# EAGLE schematic tomada (EAGLE 6.4)
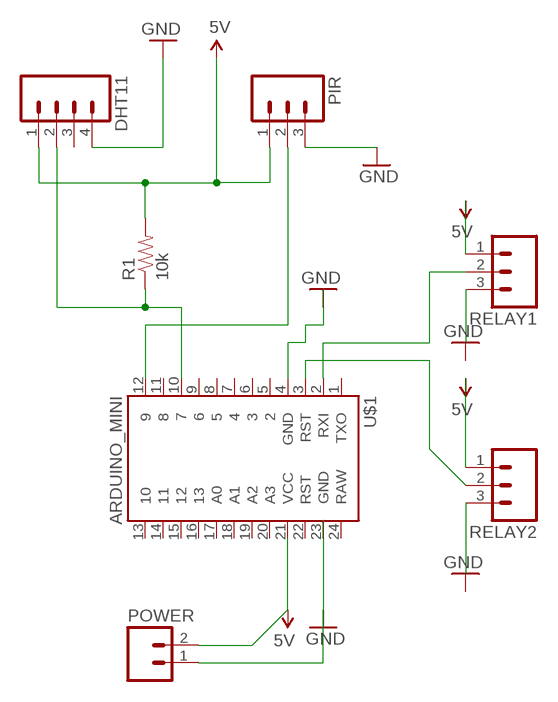
[diagram p0: schematic, sheet 1]

## Parts
DHT11  M04PTH  [1X04]
PIR  M03PTH  [1X03]
POWER  M02PTH4  [1X02_XTRA_BIG]
R1  10k  RESISTORPTH-1/4W  [AXIAL-0.4]
RELAY1  M03PTH  [1X03]
RELAY2  M03PTH  [1X03]
U$1  ARDUINO_MINI  [ARDUINO_MINI]

## Nets
5V: DHT11.1 PIR.1 POWER.2 R1.P$2 RELAY1.1 RELAY2.1 U$1.21(VCC)
GND: DHT11.4 PIR.3 POWER.1
N$1: PIR.2 U$1.12
N$2: RELAY1.2 U$1.2(RXI)
N$3: DHT11.2 R1.P$1 U$1.10
N$4: RELAY1.3
N$5: RELAY2.2 U$1.3(RST)
N$6: U$1.4(GND)
N$7: RELAY2.3
Unconnected: DHT11.3 U$1.1(TXO) U$1.5 U$1.6 U$1.7 U$1.8 U$1.9 U$1.11 U$1.13 U$1.14 U$1.15 U$1.16 U$1.17(A0) U$1.18(A1) U$1.19(A2) U$1.20(A3) U$1.22(RST) U$1.23(GND) U$1.24(RAW)

## Library data of the parts
DHT11 = SparkFun-Connectors:M04: Header 4 Standard 4-pin 0.1" header. Use with straight break away headers (SKU : PRT-00116), right angle break away headers (PRT-00553), swiss pins (PRT-00743), machine pins (PRT-00117), and female headers (PRT-00115). Molex polarized connector foot print use with SKU : PRT-08231 with associated crimp pins and housings. 1MM SMD Version SKU: PRT-10208
PIR RELAY1 RELAY2 = SparkFun-Connectors:M03: Header 3 Standard 3-pin 0.1" header. Use with straight break away headers (SKU : PRT-00116), right angle break away headers (PRT-00553), swiss pins (PRT-00743), machine pins (PRT-00117), and female headers (PRT-00115). Molex polarized connector foot print use with SKU : PRT-08232 with associated crimp pins and housings.
POWER = SparkFun-Connectors:M02: Standard 2-pin 0.1" header. Use with - straight break away headers ( PRT-00116) - right angle break away headers (PRT-00553) - swiss pins (PRT-00743) - machine pins (PRT-00117) - female headers (PRT-00115) Molex polarized connector foot print use with: PRT-08233 with associated crimp pins and housings. 2.54_SCREWTERM for use with PRT-10571. 3.5mm Screw Terminal footprints for PRT-08084 5mm Screw Terminal footprints for use with PRT-08433
R1 = SparkFun-Passives:RESISTOR: Resistor Basic schematic elements and footprints for 0603, 1206, and PTH resistors.
U$1 = SparkFun-Boards:ARDUINO_MINI: Arduino Pro Mini footprint